# Altium project ECT-CV-DIFF.PrjPCB
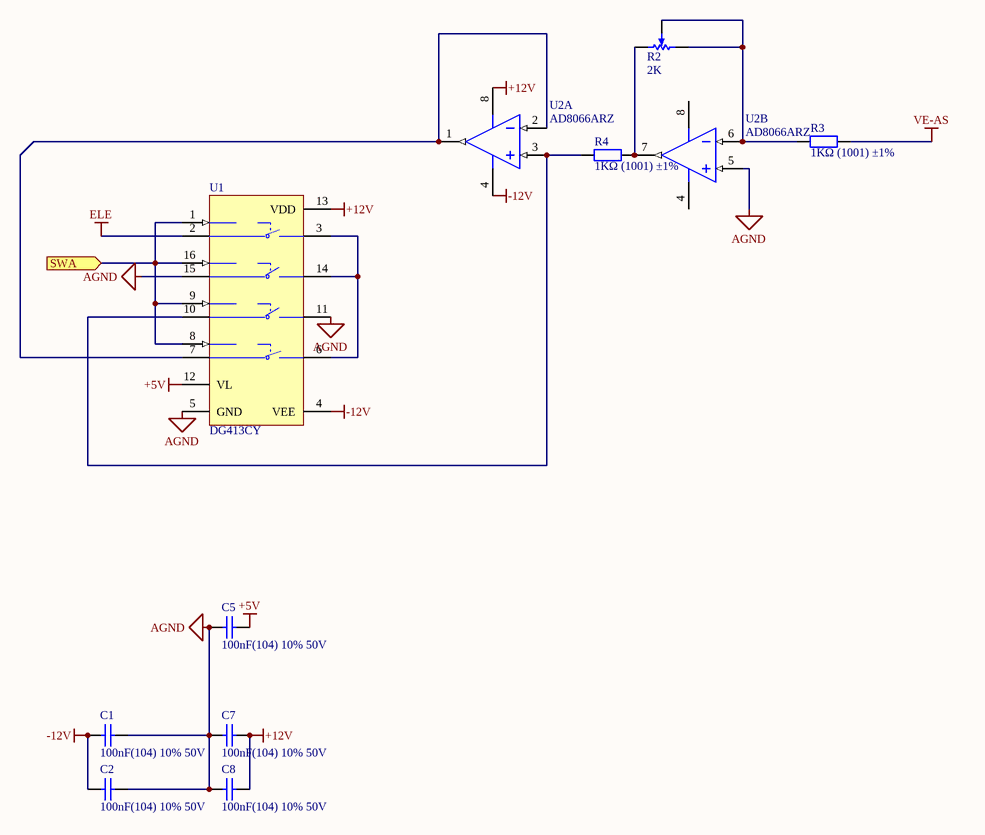
[diagram p0: CV2018-DIFFx1.SchDoc]
1 sheet, 10 parts. Net scope: flat (ports and power ports of the same name join across sheets).
Board file: CV2018-DIFF.PcbDoc

## Sheet CV2018-DIFFx1.SchDoc
size A4

### Parts
C1  100nF(104) 10% 50V  [LC-0805_C]
C2  100nF(104) 10% 50V  [LC-0805_C]
C5  100nF(104) 10% 50V  [LC-0805_C]
C7  100nF(104) 10% 50V  [LC-0805_C]
C8  100nF(104) 10% 50V  [LC-0805_C]
R2  2K  [POT4MM-2]
R3  1KΩ (1001) ±1%  [LC-0805_R]
R4  1KΩ (1001) ±1%  [LC-0805_R]
U1  DG413CY  [NSO16_N]
U2  AD8066ARZ  [ADI-R-8_N]  (parts A,B of 2)

### Ports
SWA (in)

### Nets
+5V: C5.2 U1.12(VL)
+12V: C7.2 C8.2 U1.13(VDD) U2.8(+VS)
-12V: C1.1 C2.1 U1.4(VEE) U2.4(-VS)
AGND: C1.2 C2.2 C5.1 C7.1 C8.1 U1.5(GND) U1.11(S3) U1.15(D2) U2.5(+IN_2)
ELE: U1.2(D1)
VE-AS: R3.2
NetR2_CCW: R2.CCW(-) R2.W R3.1 U2.6(-IN_2)
NetR2_CW: R2.CW(+) R4.2 U2.7(VOUT_2)
NetR4_1: R4.1 U1.10(D3) U2.3(+IN_1)
NetU1_1: U1.1(IN1) U1.8(IN_4) U1.9(IN3) U1.16(IN2) ; port SWA
NetU1_3: U1.3(S1) U1.6(S4) U1.14(S2)
NetU1_7: U1.7(D4) U2.1(VOUT_1) U2.2(-IN_1)

### Library data of the parts
C1 C2 C5 C7 C8 = 0805 100nF(104) 10% 50V: 贴片电容; ComponentLink1Description: 供应商链接; ComponentLink1URL: http://www.szlcsc.com/product/details_50686.html; Package: 0805; Supplier: LC; SuppliersPartNumber: C49678
R2 = RPot SM: Square Trimming Potentiometer; Published: 17-Dec-2003; DatasheetVersion: Oct-2003; PackageReference: POT4MM-2; Publisher: Altium Limited; PackageDescription: Square Trimming Potentiometer; ComponentLink1Description: Manufacturer Link; ComponentLink1URL: http://bourns.com/2/search.html
R3 R4 = 0805 1KΩ (1001) 1%: 贴片电阻; ComponentLink1Description: 供应商链接; ComponentLink1URL: http://www.szlcsc.com/product/details_18201.html; Package: 0805; Supplier: LC; SuppliersPartNumber: C17513
U1 = DG413CY: Improved, Quad, SPST Analog Switches; Published: 16-Jan-2001; LatestRevisionDate: 13-Apr-2006; LatestRevisionNote: IPC-7351 Footprint Added.; DatasheetVersion: Aug-1995; PackageReference: NSO16; Publisher: Altium Limited; PackageDescription: 16-Pin Small Outline Integrated Circuit 1.27 mm Pitch; Code_JEDEC: MS-012-AC; Code_IPC: SOIC127P600-16; ComponentLink1Description: Manufacturer Link; ComponentLink1URL: http://www.maxim-ic.com/; ComponentLink2Description: Datasheet; ComponentLink2URL: http://pdfserv.maxim-ic.com/en/ds/DG411-DG413.pdf
U2 = AD8066ARZ: Double Channel Low Power Operational Amplifier, 145 MHz BW, 180 V/us SR, Industrial, 8-pin SOIC (R-8), Tube; Generic Part Number: AD8066; Manufacturer: Analog Devices; Amplifiers Per Package: 2; Input Bias Current: 2pA; Input Offset Voltage: 400uV; Iq/Amp: 7.4mA; Small Signal Bandwidth: 145MHz; V Span Max: 24V; V Span Min: 5V; DatasheetVersion: Rev. J; PackageVersion: 060506-A; PackageReference: R-8; PackageDescription: 8-Pin Standard Small Outline Package, Body 3.9 x 4.9 mm, Pitch 1.27 mm; Supplier 1: Digi-Key; Supplier Part Number 1: AD8066ARZ-ND; Supplier 2: Farnell; Supplier Part Number 2: 8621535; Supplier 3: Newark; Supplier Part Number 3: 59K6322; Slew Rate: 180V/us; Mounting Technology: Surface Mount; Code_JEDEC: MS-012-AA; PartNumber: AD8066ARZ; ComponentLink1Description: Manufacturer URL; ComponentLink1URL: http://www.analog.com/en/index.html; ComponentLink2Description: Datasheet; ComponentLink2URL: http://www.analog.com/static/imported-files/data_sheets/AD8065_8066.pdf; ComponentLink3Description: Package Specification; ComponentLink3URL: http://www.analog.com/static/imported-files/packages/PKG_PDF/SOIC_Narrow%20(R)/R_8.pdf; ComponentLink4Description: Reference Circuit; ComponentLink4URL: http://www.analog.com/en/all-operational-amplifiers-op-amps/operational-amplifiers-op-amps/ad8066/products/product.html#product-recommendations